# Altium project JTAG.PrjPCB
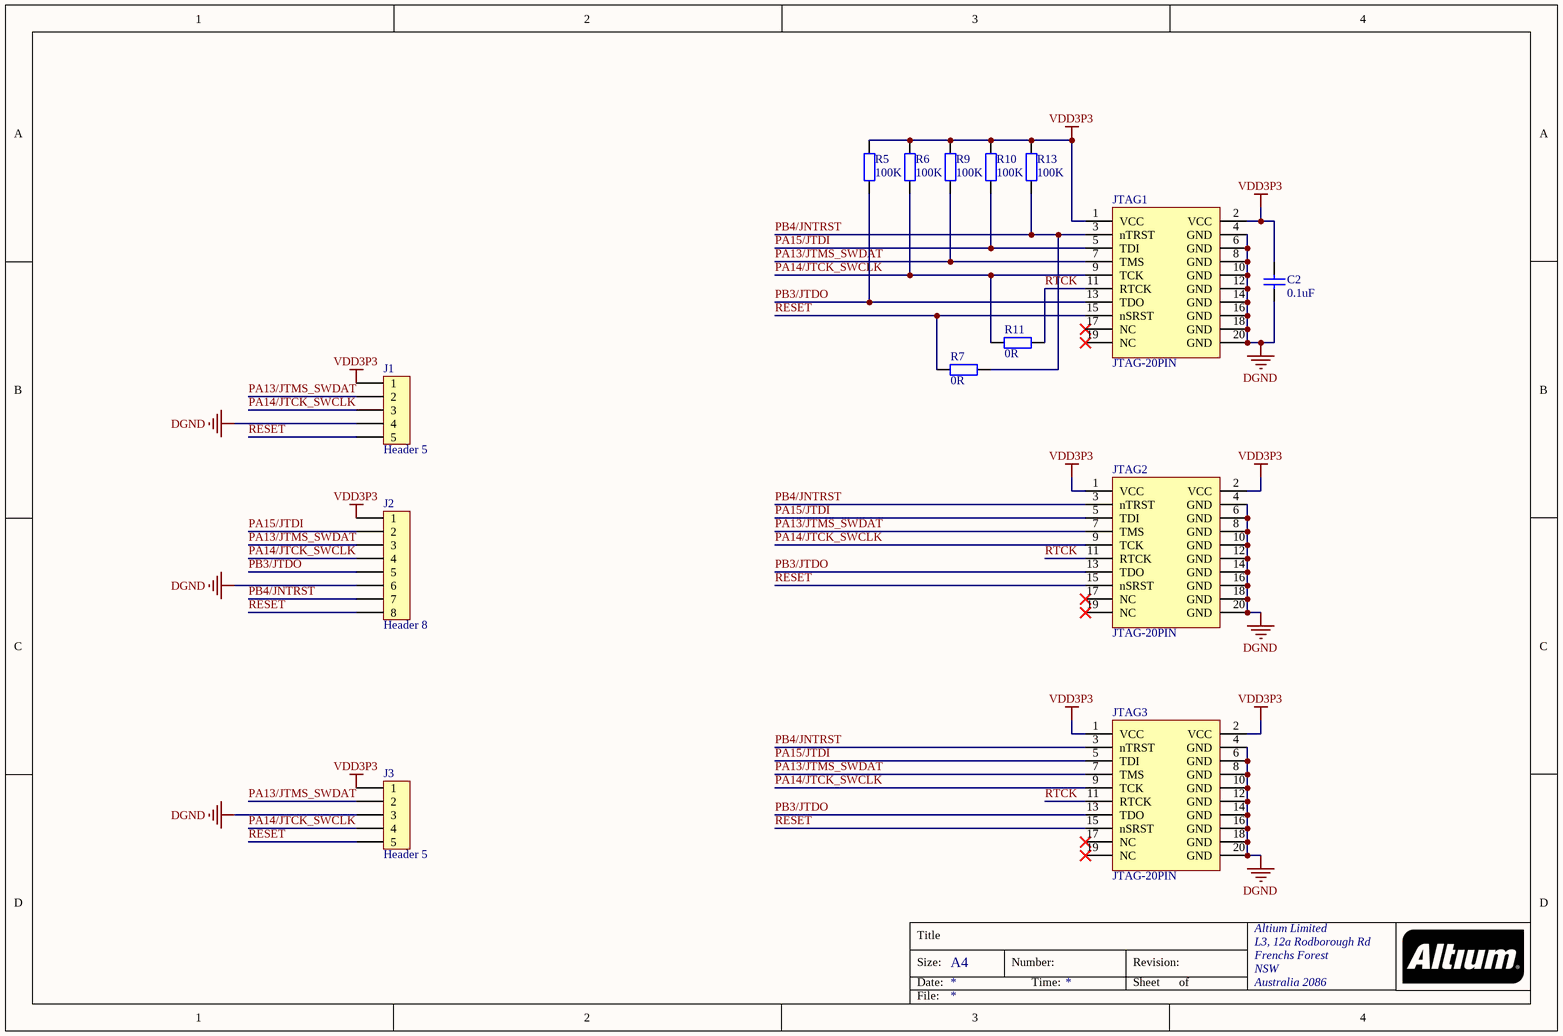
[diagram p0: JTAG.SchDoc]
1 sheet, 14 parts. Net scope: global (net labels, ports and power ports of the same name join across sheets).
Board file: JTAG.PcbDoc

## Sheet JTAG.SchDoc
size A4; Organization: Altium Limited; Address1: L3, 12a Rodborough Rd; Address2: Frenchs Forest; Address3: NSW; Address4: Australia 2086

### Parts
C2  value 0.1uF  [CAPC1608X90N]  (hidden comment: Cap)
J1  Header 5  [HDR5X1_B1_1.25]
J2  Header 8  [HDR8X1_B1_1.25]
J3  Header 5  [HDR5X1_B1]
JTAG1  JTAG-20PIN  [HDR10X2_E2]
JTAG2  JTAG-20PIN  [HDR10X2_A1]
JTAG3  JTAG-20PIN  [HDR10X2_A1]
R5  value 100K  [RESC1608X50N]  (hidden comment: RES)
R6  value 100K  [RESC1608X50N]  (hidden comment: RES)
R7  value 0R  [RESC1608X50N]  (hidden comment: RES)
R9  value 100K  [RESC1608X50N]  (hidden comment: RES)
R10  value 100K  [RESC1608X50N]  (hidden comment: RES)
R11  value 0R  [RESC1608X50N]  (hidden comment: RES)
R13  value 100K  [RESC1608X50N]  (hidden comment: RES)

### Nets
DGND: C2.1 J1.4 J2.6 J3.3 JTAG1.4(GND) JTAG1.6(GND) JTAG1.8(GND) JTAG1.10(GND) JTAG1.12(GND) JTAG1.14(GND) JTAG1.16(GND) JTAG1.18(GND) JTAG1.20(GND) JTAG2.4(GND) JTAG2.6(GND) JTAG2.8(GND) JTAG2.10(GND) JTAG2.12(GND) JTAG2.14(GND) JTAG2.16(GND) JTAG2.18(GND) JTAG2.20(GND) JTAG3.4(GND) JTAG3.6(GND) JTAG3.8(GND) JTAG3.10(GND) JTAG3.12(GND) JTAG3.14(GND) JTAG3.16(GND) JTAG3.18(GND) JTAG3.20(GND)
VDD3P3: C2.2 J1.1 J2.1 J3.1 JTAG1.1(VCC) JTAG1.2(VCC) JTAG2.1(VCC) JTAG2.2(VCC) JTAG3.1(VCC) JTAG3.2(VCC) R5.2 R6.2 R9.2 R10.2 R13.2
PA13/JTMS_SWDAT: J1.2 J2.3 J3.2 JTAG1.7(TMS) JTAG2.7(TMS) JTAG3.7(TMS) R9.1
PA14/JTCK_SWCLK: J1.3 J2.4 J3.4 JTAG1.9(TCK) JTAG2.9(TCK) JTAG3.9(TCK) R6.1 R11.1
PA15/JTDI: J2.2 JTAG1.5(TDI) JTAG2.5(TDI) JTAG3.5(TDI) R10.1
PB3/JTDO: J2.5 JTAG1.13(TDO) JTAG2.13(TDO) JTAG3.13(TDO) R5.1
PB4/JNTRST: J2.7 JTAG1.3(nTRST) JTAG2.3(nTRST) JTAG3.3(nTRST) R7.2 R13.1
RESET: J1.5 J2.8 J3.5 JTAG1.15(nSRST) JTAG2.15(nSRST) JTAG3.15(nSRST) R7.1
RTCK: JTAG1.11(RTCK) JTAG2.11(RTCK) JTAG3.11(RTCK) R11.2

Not connected (* = marked no-connect by the designer): JTAG1 17(NC)* 19(NC)*; JTAG2 17(NC)* 19(NC)*; JTAG3 17(NC)* 19(NC)*

### Notes on the sheet
- Title
- Size:
- Date:
- A4
- Number:
- Time:
- Revision:
- Sheet
- of
- File:

### Library data of the parts
C2 = Cap: Capacitor; Published: 8-Jun-2000; LatestRevisionDate: 17-Jul-2002; LatestRevisionNote: Re-released for DXP Platform.; PackageReference: RAD-0.3; Publisher: Altium Limited
J1 J3 = Header 5: Header,5-Pin
J2 = Header 8: Header, 8-Pin; LatestRevisionDate: 17-Jul-2002; LatestRevisionNote: Re-released for DXP Platform.; Publisher: Altium Limited
JTAG1-JTAG3 = ARM_JTAG: ARM_JTAG-20PIN
R5-R7 R9-R11 R13 = RES: 贴片电阻; Published: 8-Jun-2000; LatestRevisionDate: 17-Jul-2002; LatestRevisionNote: Re-released for DXP Platform.; PackageReference: AXIAL-0.4; Publisher: Altium Limited